# EAGLE schematic tinySensor (EAGLE 9.3.0)
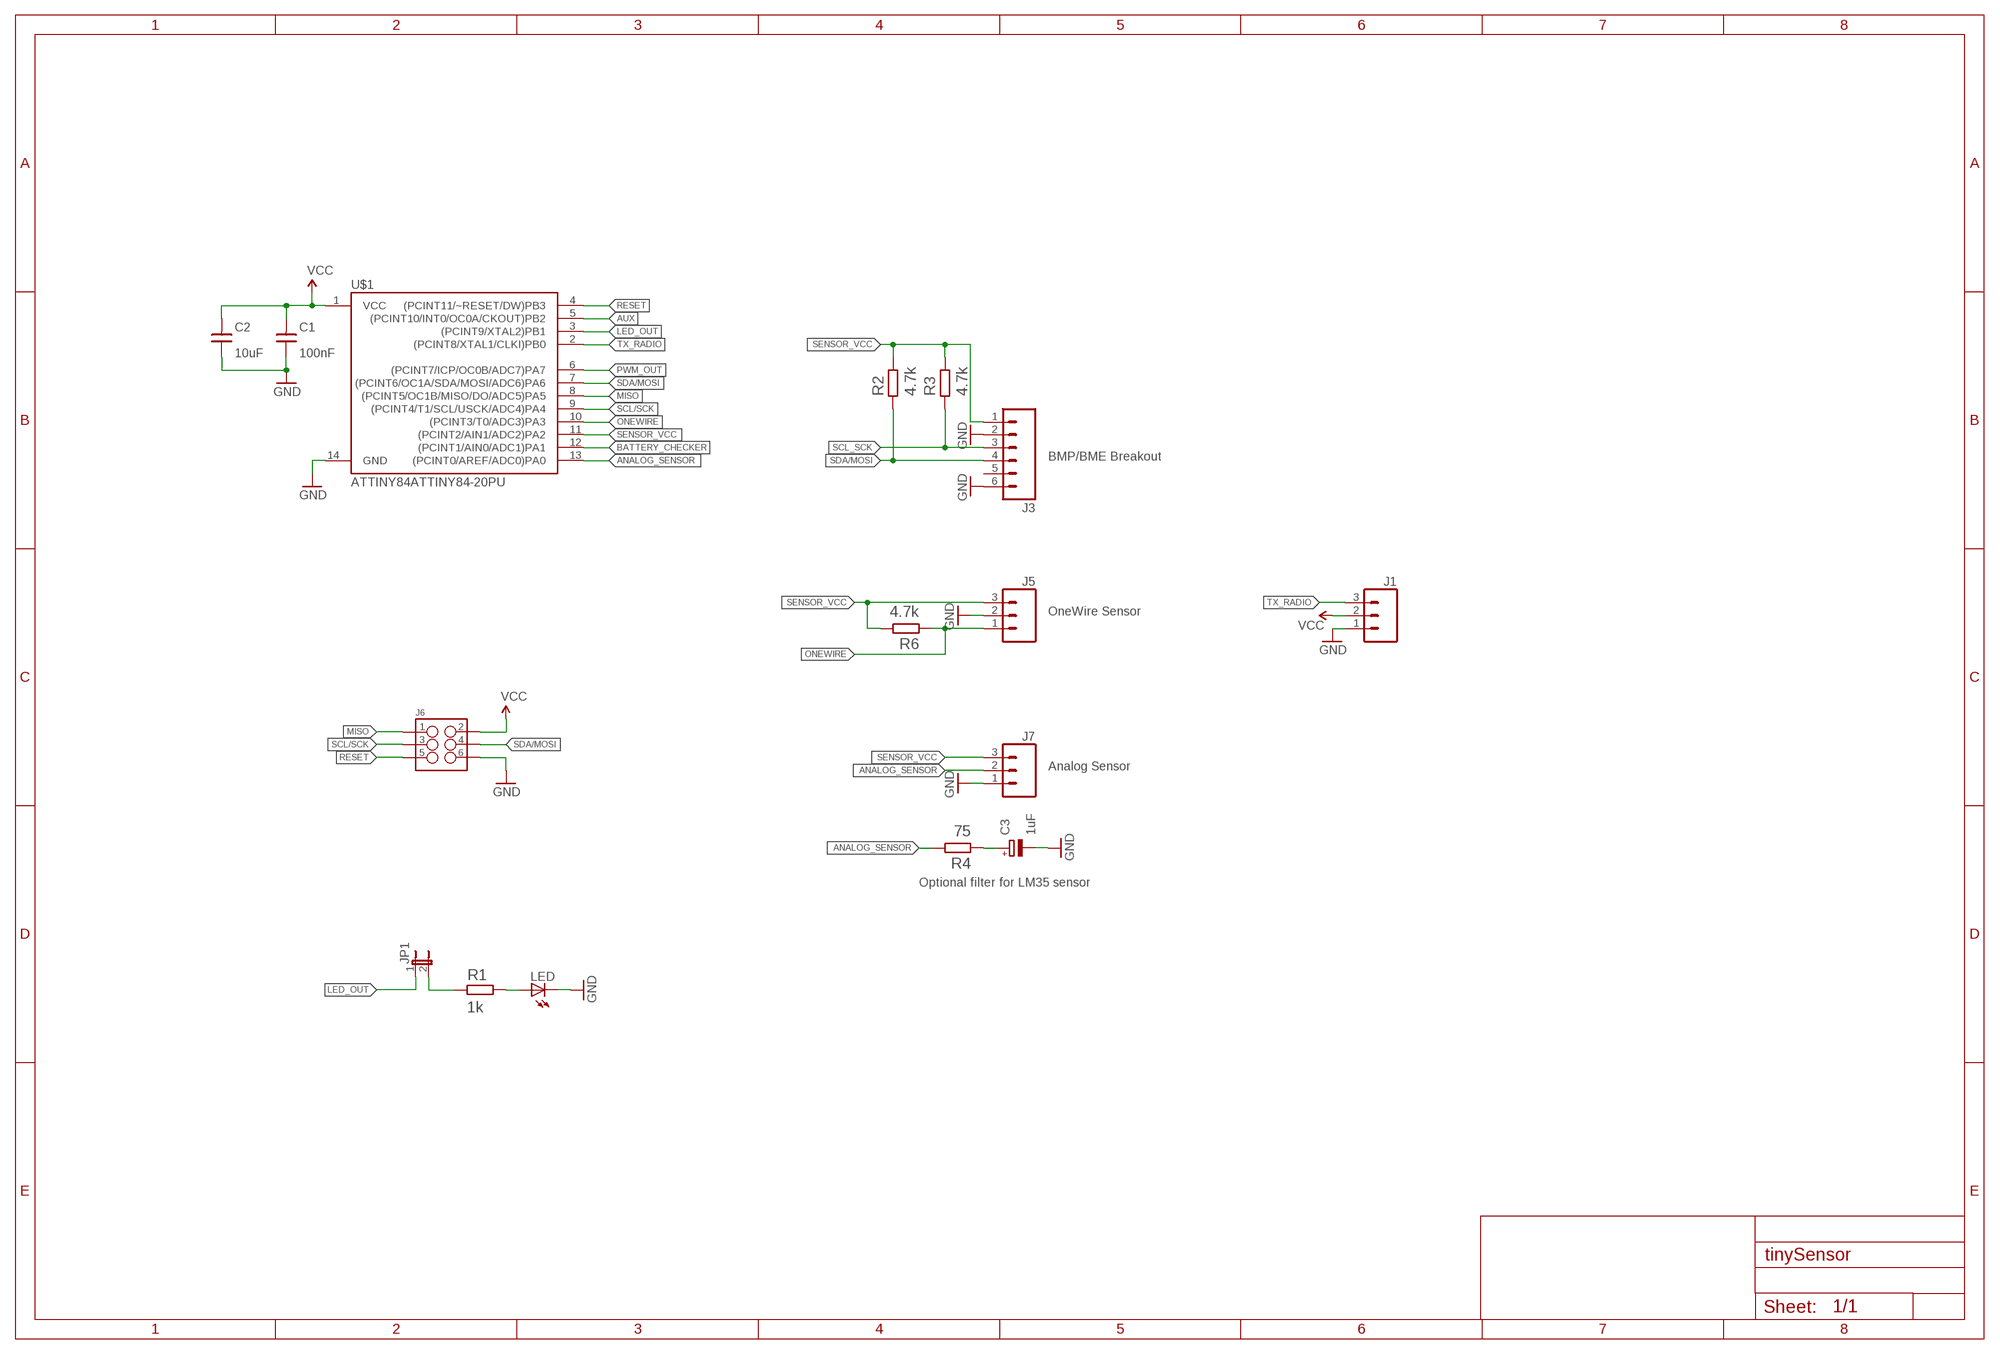
[diagram p0: schematic, sheet 1]

## Parts
C1  100nF  C0805  [R0805]
C2  10uF  C0805  [R0805]
C3  1uF  CPOL-EUC  [PANASONIC_C]
J1  M03PTH  [1X03]
J3  M06SIP  [1X06]
J5  M03PTH  [1X03]
J6  M03X2SHROUD  [2X3-SHROUDED]
J7  M03PTH  [1X03]
JP1  JUMPER-2PTH  [1X02]
LED  LED3MM  [LED3MM]
R1  1k  R0805  [R0805]
R2  4.7k  R0805  [R0805]
R3  4.7k  R0805  [R0805]
R4  75  R0805  [R0805]
R6  4.7k  R0805  [R0805]
U$1  ATTINY84ATTINY84-20PU  [DIL14]

## Nets
ANALOG_SENSOR: J7.2 R4.2 U$1.13((PCINT0/AREF/ADC0)PA0)
AUX: U$1.5((PCINT10/INT0/OC0A/CKOUT)PB2)
BATTERY_CHECKER: U$1.12((PCINT1/AIN0/ADC1)PA1)
GND: C1.1 C2.1 C3.- J1.1 J3.2 J3.6 J5.2 J6.6 J7.1 LED.K(C) U$1.14(GND)
LED_OUT: JP1.1 U$1.3((PCINT9/XTAL2)PB1)
MISO: J6.1 U$1.8((PCINT5/OC1B/MISO/DO/ADC5)PA5)
N$1: JP1.2 R1.1
N$2: LED.A R1.2
N$4: C3.+ R4.1
ONEWIRE: J5.1 R6.1 U$1.10((PCINT3/T0/ADC3)PA3)
PWM_OUT: U$1.6((PCINT7/ICP/OC0B/ADC7)PA7)
RESET: J6.5 U$1.4((PCINT11/~RESET/DW)PB3)
SCL/SCK: J6.3 U$1.9((PCINT4/T1/SCL/USCK/ADC4)PA4)
SCL_SCK: J3.3 R3.1
SDA/MOSI: J3.4 J6.4 R2.1 U$1.7((PCINT6/OC1A/SDA/MOSI/ADC6)PA6)
SENSOR_VCC: J3.1 J5.3 J7.3 R2.2 R3.2 R6.2 U$1.11((PCINT2/AIN1/ADC2)PA2)
TX_RADIO: J1.3 U$1.2((PCINT8/XTAL1/CLKI)PB0)
VCC: C1.2 C2.2 J1.2 J6.2 U$1.1(VCC)
Unconnected: J3.5

## Notes on the sheet
- BMP/BME Breakout
- OneWire Sensor
- Analog Sensor
- Optional filter for LM35 sensor

## Library data of the parts
C1 C2 = 0SBLib:C
C3 = rcl:CPOL-EU: POLARIZED CAPACITOR, European symbol; SPICEPREFIX: C
J1 J5 J7 = 0SBLib:M03: Header 3 Standard 3-pin 0.1" header. Use with straight break away headers (SKU : PRT-00116), right angle break away headers (PRT-00553), swiss pins (PRT-00743), machine pins (PRT-00117), and female headers (PRT-00115). Molex polarized connector foot print use with SKU : PRT-08232 with associated crimp pins and housings.
J3 = SparkFun-Connectors:M06: Header 6 Standard 6-pin 0.1" header. Use with straight break away headers (SKU : PRT-00116), right angle break away headers (PRT-00553), swiss pins (PRT-00743), machine pins (PRT-00117), and female headers (PRT-00115). Molex polarized connector foot print use with SKU : PRT-08094 with associated crimp pins and housings. NOTES ON THE VARIANTS LOCK and LOCK_LONGPADS... This footprint was designed to help hold the alignment of a through-hole component (i.e. 6-pin header) while soldering it into place. You may notice that each hole has been shifted either up or down by 0.005 of an inch from it's more standard position (which is a perfectly straight line). This slight alteration caused the pins (the squares in the middle) to touch the edges of the holes. Because they are alternating, it causes a "brace" to hold the component in place. 0.005 has proven to be the perfect amount of "off-center" position when using our standard breakaway headers. Although looks a little odd when you look at the bare footprint, once you have a header in there, the alteration is very hard to notice. Also,if you push a header all the way into place, it is covered up entirely on the bottom side. This idea of altering the position of holes to aid alignment will be further integrated into the Sparkfun Library for other footprints. It can help hold any component with 3 or more connection pins.
J6 = SparkFun-Connectors:M03X2: 2x3 .1" header. Shrouded, with keying- CONN-10681 SMT- CONN-11415 Pogo pins- HW-11044; PROD_ID: CONN-10681
JP1 = SparkFun-Retired:JUMPER-2: Jumper Basic 0.1" spaced jumper. Use with breakaway headers.
LED = 0SBLib:LED: LEDs Standard schematic elements and footprints for 5mm, 3mm, 1206, and 0603 sized LEDs. 5mm - Spark Fun Electronics SKU : COM-00529 (and others)
R1-R4 R6 = 0SBLib:R
U$1 = SparkFun-DigitalIC:ATTINY84: Atmel 14-pin 2/4/8kB flash uC